# EasyEDA schematic programador ATtiny easyeda.json
TITLE: Programador de ATtiny25/45/85; REV: 1.0; Date: 2022-01-11; Sheet: 1/1; Drawn By: robert382; Company: Spectra
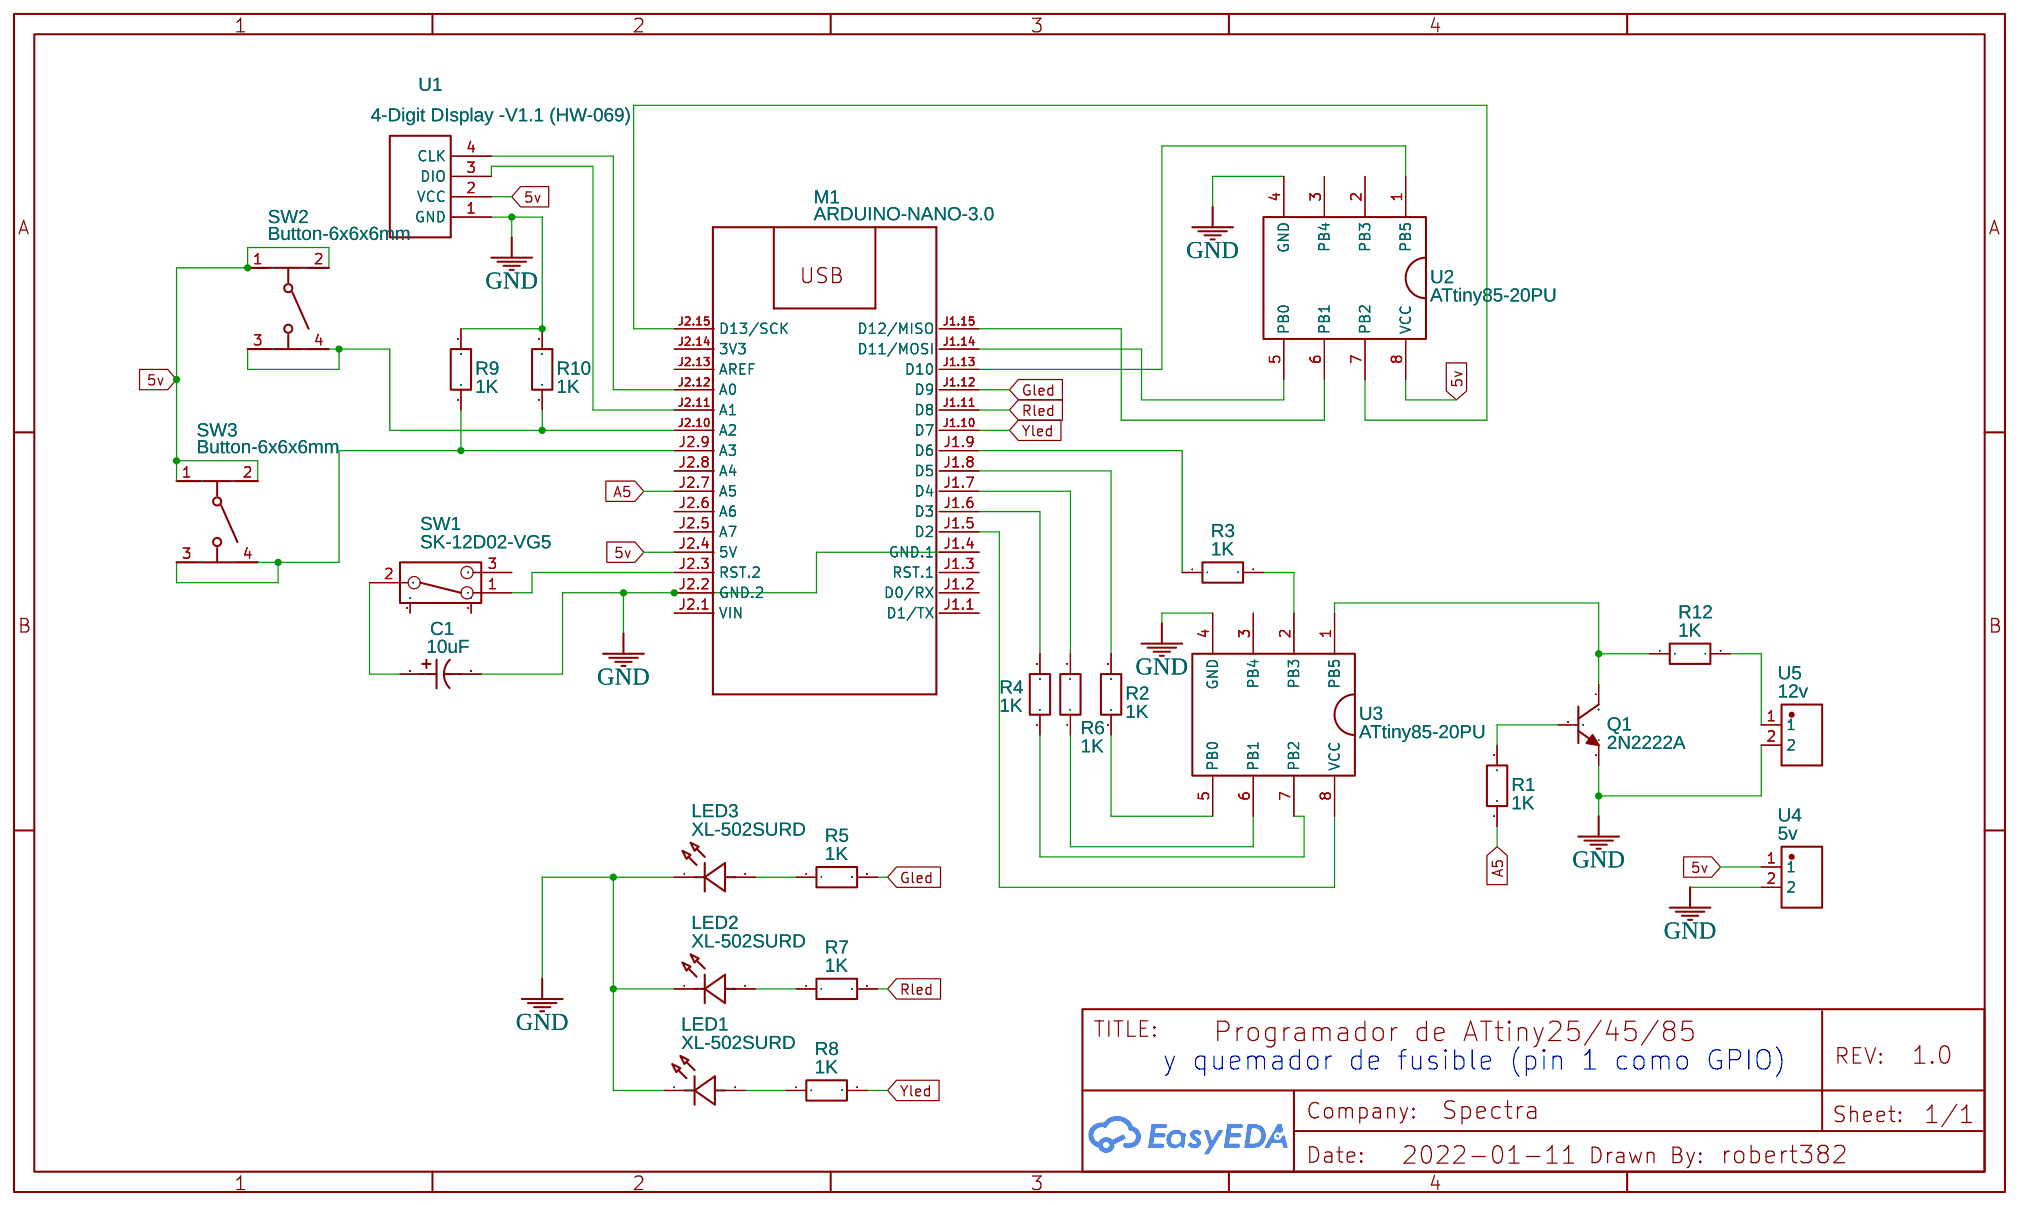
[diagram p0: schematic sheet]

## Parts
C1  10uF  [CAP-TH_BD5.0-P2.00-D0.5-FD]
LED1  XL-502SURD  [LED-TH_BD5.9-P2.54-RD_RED]
LED2  XL-502SURD  [LED-TH_BD5.9-P2.54-RD_RED]
LED3  XL-502SURD  [LED-TH_BD5.9-P2.54-RD_RED]
M1  ARDUINO-NANO-3.0  [ARDUINO-NANO-3.0]
Q1  2N2222A  [TO-92-3_L4.8-W3.7-P2.54-R]
R1  1K  [RES-TH_BD1.9-L3.3-P7.30-D0.5]
R2  1K  [RES-TH_BD1.9-L3.3-P7.30-D0.5]
R3  1K  [RES-TH_BD1.9-L3.3-P7.30-D0.5]
R4  1K  [RES-TH_BD1.9-L3.3-P7.30-D0.5]
R5  1K  [RES-TH_BD1.9-L3.3-P7.30-D0.5]
R6  1K  [RES-TH_BD1.9-L3.3-P7.30-D0.5]
R7  1K  [RES-TH_BD1.9-L3.3-P7.30-D0.5]
R8  1K  [RES-TH_BD1.9-L3.3-P7.30-D0.5]
R9  1K  [RES-TH_BD1.9-L3.3-P7.30-D0.5]
R10  1K  [RES-TH_BD1.9-L3.3-P7.30-D0.5]
R12  1K  [RES-TH_BD1.9-L3.3-P7.30-D0.5]
SW1  SK-12D02-VG5  [SW-TH_SK-12D02-VG5]
SW2  Button-6x6x6mm  [SW-TH_4P-L6.0-W6.0-P4.50-LS6.1]
SW3  Button-6x6x6mm  [SW-TH_4P-L6.0-W6.0-P4.50-LS6.1]
U1  4-Digit DIsplay -V1.1 (HW-069)  [4-DIGIT DISPLAY -V1.1 (HW-069)]
U2  ATtiny85-20PU  [ATTINY85-20PU]
U3  ATtiny85-20PU  [ATTINY85-20PU]
U4  5v  [CONN-TH_KY0200500000G]
U5  12v  [CONN-TH_KY0200500000G]

## Library data of the parts
C1 = RA3-50V100ME3#: Supplier: LCSC; Supplier Part: C399591; Manufacturer: ELNA(伊娜); Contributor: LCSC
LED1-LED3 = XL-502SURD: Supplier: LCSC; Supplier Part: C2895492; Manufacturer: XINGLIGHT(成兴光); Contributor: LCSC
M1 = ARDUINO-NANO-3.0: Contributor: Azias
Q1 = 2N2222A: Supplier: LCSC; Supplier Part: C358533; Manufacturer: Foshan Blue Rocket Elec; Contributor: LCSC; JLCPCB Part Class: Extended Part
R1-R10 R12 = MFR0W8F1001A50_C61238: Supplier: LCSC; Supplier Part: C61238; Manufacturer: Uniroyal Elec; Manufacturer Part: MFR0W8F1001A50; Contributor: LCSC; JLCPCB Part Class: Extended Part
SW1 = SK-12D02-VG5: Supplier: LCSC; Supplier Part: C136722; Manufacturer: Rectangular Connectors - Contacts; Contributor: LCSC; JLCPCB Part Class: Extended Part
SW2 SW3 = Button-6x6x6mm: Supplier Part: C71836; Supplier: LCSC; Manufacturer: BBJ; Manufacturer Part: Switch,6*6*6Plastic head,260G, 0.25mm,Straight line
U1 = 4-Digit DIsplay -V1.1 (HW-069): Contributor: HernanGM
U2 U3 = ATtiny85-20PU: Manufacturer: Microchip; Supplier: Mouser; Supplier Part: 556-ATTINY85-20PU; link: https://www.mouser.co.uk/ProductDetail/Microchip-Technology-Atmel/ATTINY85-20PU?qs=8jWQYweyg6NCiiaOb5GI9Q==; Contributor: Guest
U4 U5 = KY0200500000G: Supplier: LCSC; Supplier Part: C967069; Manufacturer: Amphenol; Contributor: LCSC

## Nets
5v: M1.J2.4(5V) SW2.1 SW2.2 SW3.1 SW3.2 U1.2(VCC) U2.8(VCC) U4.1
GND: C1.2 LED1.1(K) LED2.1(K) LED3.1(K) M1.J1.4(GND.1) M1.J2.2(GND.2) Q1.3(E) R9.2 R10.2 U1.1(GND) U2.4(GND) U3.4(GND) U4.2 U5.2
A5: M1.J2.7(A5) R1.1
Gled: M1.J1.12(D9) R5.2
Rled: M1.J1.11(D8) R7.2
Yled: M1.J1.10(D7) R8.2
Net-(C1-1): C1.1 SW1.2
Net-(LED1-2): LED1.2(A) R8.1
Net-(LED2-2): LED2.2(A) R7.1
Net-(LED3-2): LED3.2(A) R5.1
Net-(M1-J1.5): M1.J1.5(D2) U3.8(VCC)
Net-(M1-J1.6): M1.J1.6(D3) R4.2
Net-(M1-J1.7): M1.J1.7(D4) R6.2
Net-(M1-J1.8): M1.J1.8(D5) R2.2
Net-(M1-J1.9): M1.J1.9(D6) R3.1
Net-(M1-J1.13): M1.J1.13(D10) U2.1(PB5)
Net-(M1-J1.14): M1.J1.14(D11/MOSI) U2.5(PB0)
Net-(M1-J1.15): M1.J1.15(D12/MISO) U2.6(PB1)
Net-(M1-J2.3): M1.J2.3(RST.2) SW1.1
Net-(M1-J2.9): M1.J2.9(A3) R9.1 SW3.3 SW3.4
Net-(M1-J2.10): M1.J2.10(A2) R10.1 SW2.3 SW2.4
Net-(M1-J2.11): M1.J2.11(A1) U1.3(DIO)
Net-(M1-J2.12): M1.J2.12(A0) U1.4(CLK)
Net-(M1-J2.15): M1.J2.15(D13/SCK) U2.7(PB2)
Net-(Q1-1): Q1.1(C) R12.1 U3.1(PB5)
Net-(Q1-2): Q1.2(B) R1.2
Net-(R2-1): R2.1 U3.5(PB0)
Net-(R3-2): R3.2 U3.2(PB3)
Net-(R4-1): R4.1 U3.7(PB2)
Net-(R6-1): R6.1 U3.6(PB1)
Net-(R12-2): R12.2 U5.1

Not connected (* = marked no-connect by the designer): M1 J1.1(D1/TX) J1.2(D0/RX) J1.3(RST.1) J2.1(VIN) J2.5(A7) J2.6(A6) J2.8(A4) J2.13(AREF) J2.14(3V3); SW1 3 4 5; U2 2(PB3) 3(PB4); U3 3(PB4)

## Notes on the sheet
- y quemador de fusible (pin 1 como GPIO)
